# Altium schematic sheet Sensor Board.SchDoc
size A3; SheetNumber: 5; SheetTotal: 5
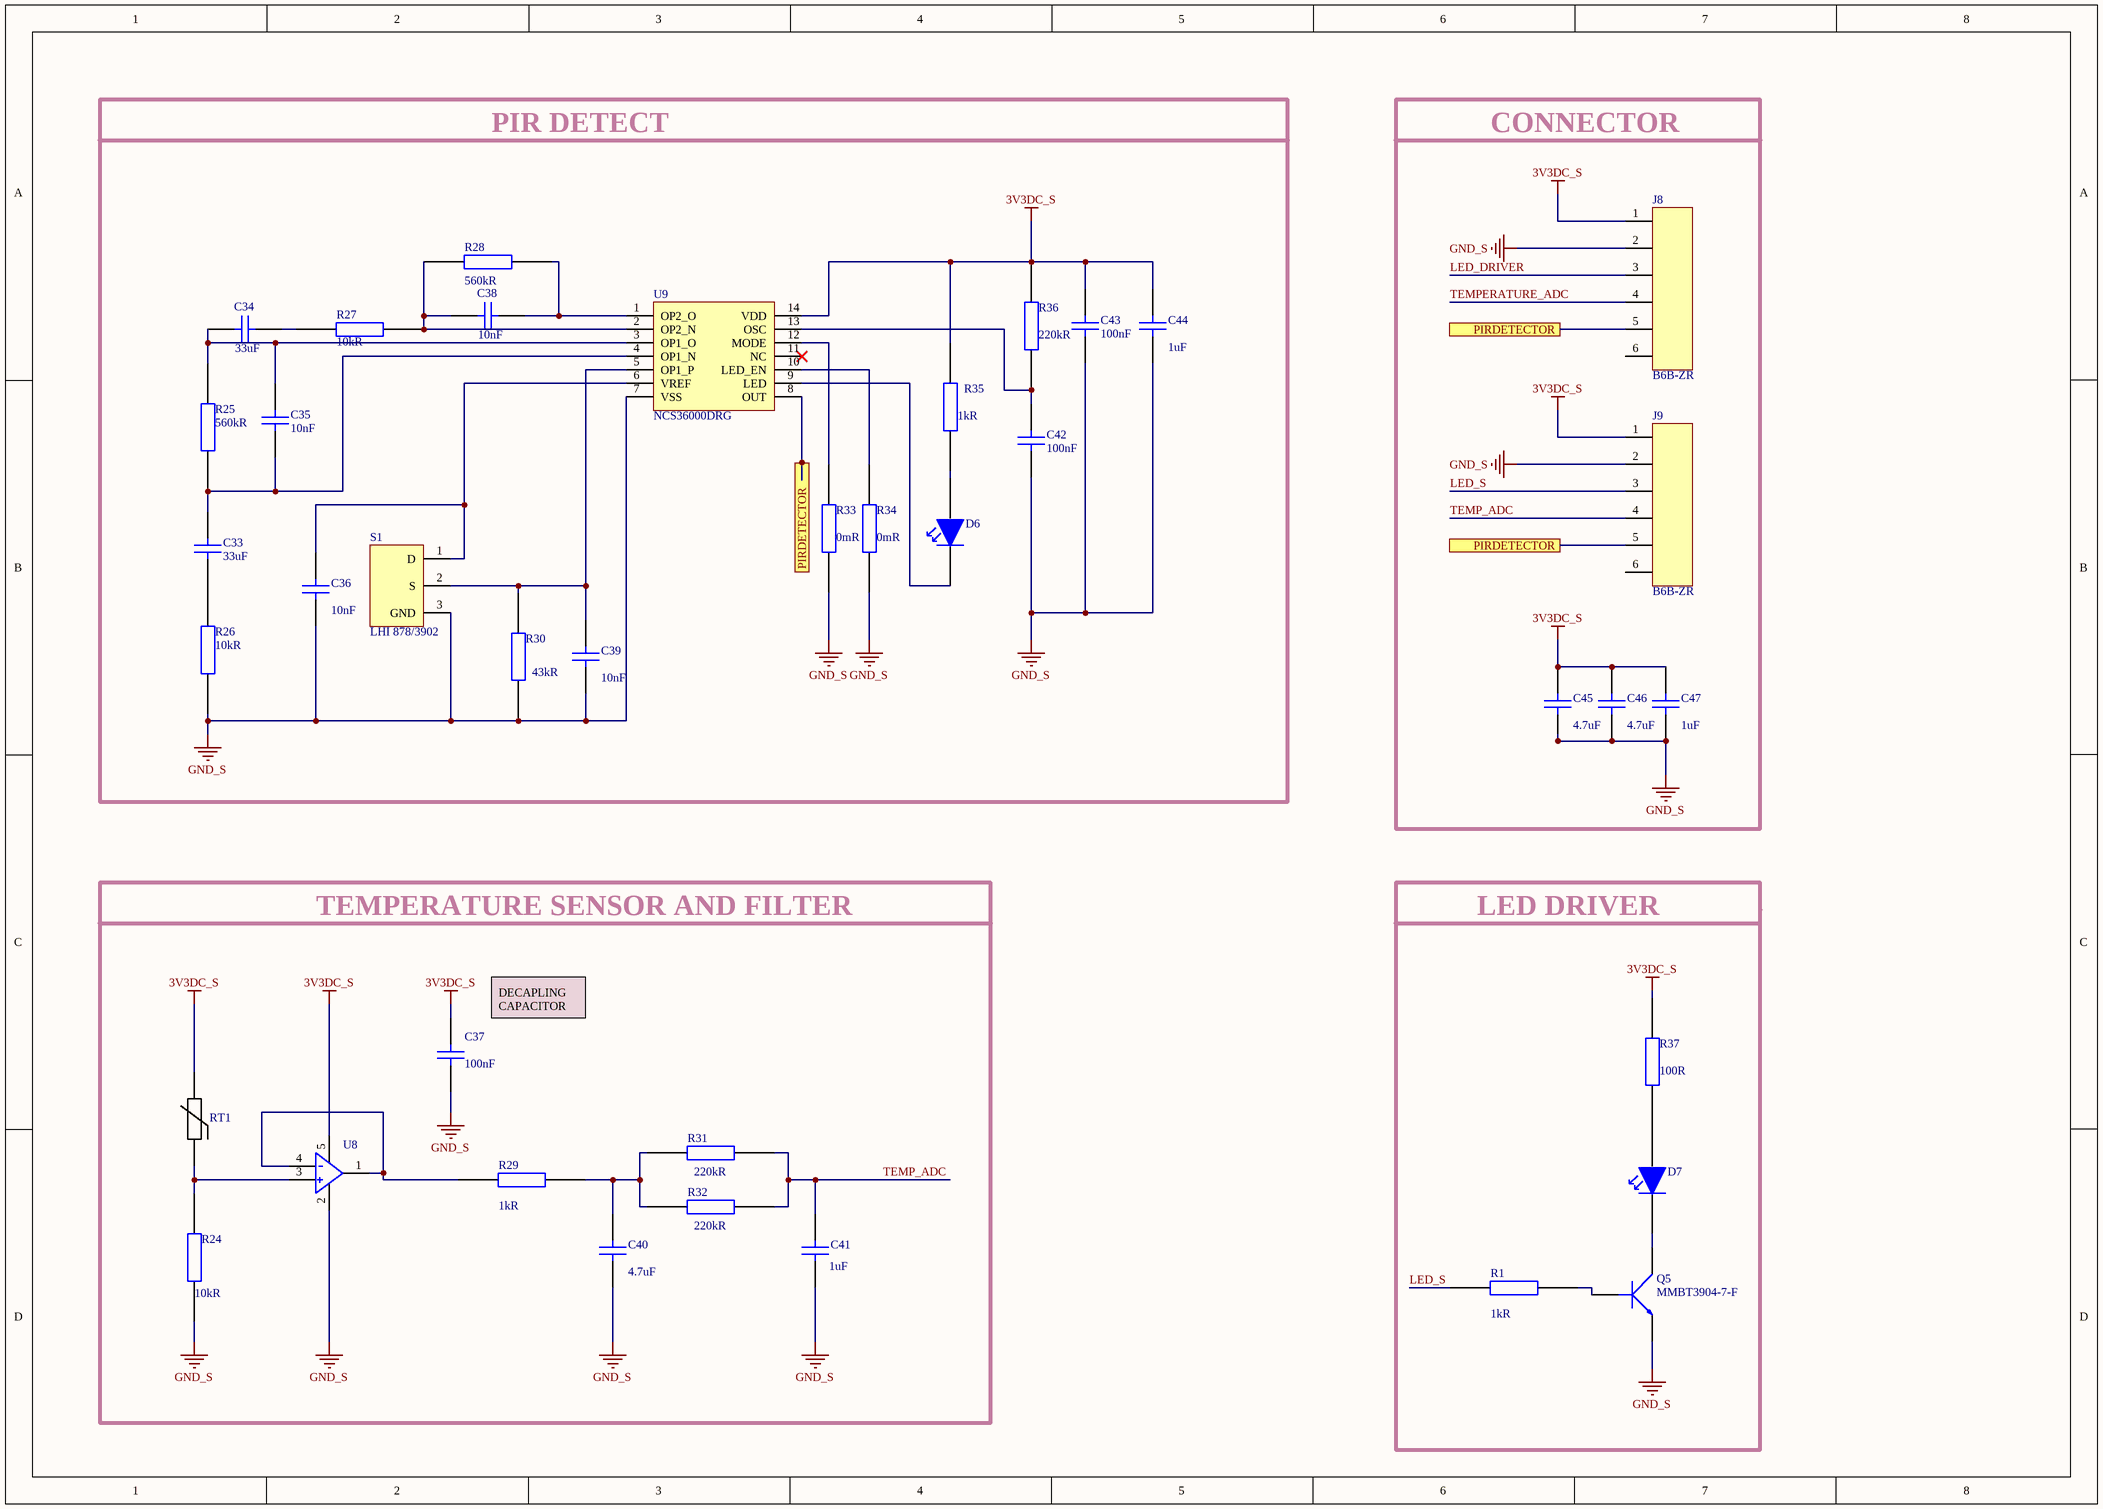
[diagram p0: Sensor Board.SchDoc]

## Parts
C33  value 33uF  [CAP_1206]  (hidden comment: C3216X5R1E336M160AC)
C34  value 33uF  [CAP_1206]  (hidden comment: C3216X5R1E336M160AC)
C35  Values: 10nF  [CAP_0603]  (hidden comment: 0603B103K160CT)
C36  Values: 10nF  [CAP_0603]  (hidden comment: 0603B103K160CT)
C37  value 100nF  [CAP_0603]  (hidden comment: C0603C104K5RAC7867)
C38  Values: 10nF  [CAP_0603]  (hidden comment: 0603B103K160CT)
C39  Values: 10nF  [CAP_0603]  (hidden comment: 0603B103K160CT)
C40  value 4.7uF  [CAP_0805]  (hidden comment: CL21A475KAQNNNE)
C41  value 1uF  [CAP_0805]  (hidden comment: CL21B105KBFNNNE)
C42  value 100nF  [CAP_0603]  (hidden comment: C0603C104K5RAC7867)
C43  value 100nF  [CAP_0603]  (hidden comment: C0603C104K5RAC7867)
C44  value 1uF  [CAP_0805]  (hidden comment: CL21B105KBFNNNE)
C45  value 4.7uF  [CAP_0805]  (hidden comment: CL21A475KAQNNNE)
C46  value 4.7uF  [CAP_0805]  (hidden comment: CL21A475KAQNNNE)
C47  value 1uF  [CAP_0805]  (hidden comment: CL21B105KBFNNNE)
D6  LTST-C171GKT  [LED_GREEN_0805]  (value not drawn)
D7  LH R974-LP-1-0-20-R18  [LED_RED_0805]  (value not drawn)
J8  B6B-ZR  [B6B-ZR]
J9  B6B-ZR  [B6B-ZR]
Q5  MMBT3904-7-F  [SOT-23F]
R1  value 1kR  [RES_0603]  (hidden comment: RC0603FR-0710KL)
R24  value 10kR  [RES_0603]  (hidden comment: RMCF0603JT10K0)
R25  value 560kR  [RES_0603]  (hidden comment: RC0603JR-07560KL)
R26  value 10kR  [RES_0603]  (hidden comment: RMCF0603JT10K0)
R27  value 10kR  [RES_0603]  (hidden comment: RMCF0603JT10K0)
R28  value 560kR  [RES_0603]  (hidden comment: RC0603JR-07560KL)
R29  value 1kR  [RES_0603]  (hidden comment: RC0603FR-0710KL)
R30  Values: 43kR  [RES_0603]  (hidden comment: RC0603JR-0743KL)
R31  Values: 220kR  [RES_0603]  (hidden comment: RC0603JR-07220KL)
R32  Values: 220kR  [RES_0603]  (hidden comment: RC0603JR-07220KL)
R33  value 0mR  [RES_0603]  (hidden comment: RC0603JR-070RL)
R34  value 0mR  [RES_0603]  (hidden comment: RC0603JR-070RL)
R35  value 1kR  [RES_0603]  (hidden comment: RC0603FR-0710KL)
R36  Values: 220kR  [RES_0603]  (hidden comment: RC0603JR-07220KL)
R37  value 100R  [RES_0603]  (hidden comment: RC0603FR-07100RL)
RT1  TFPT1206L1002FM  [RES_1206]  (value not drawn)
S1  LHI 878/3902  [LHI 878]
U8  OPA314AIDBVR  [SOT23_5]  (value not drawn)
U9  NCS36000DRG  [SOIC14]

## Ports
PIRDETECTOR (see Microcontroller[3B], Power Manangement[6D], Sensor Board[4B], Sensor Board[6A]), PIRDETECTOR (see Microcontroller[3B], Power Manangement[6D], Sensor Board[4B], Sensor Board[6B]), PIRDETECTOR (see Microcontroller[3B], Power Manangement[6D], Sensor Board[6A], Sensor Board[6B])

## Nets
3V3DC_S: C37.2 C43.2 C44.2 C45.2 C46.2 C47.2 J8.1 J9.1 R35.2 R36.1 R37.2 RT1.2 U8.5 U9.14(VDD)
GND_S: C36.1 C37.1 C39.1 C40.1 C41.2 C42.1 C43.1 C44.1 C45.1 C46.1 C47.1 J8.2 J9.2 Q5.2(E) R24.2 R26.1 R30.2 R33.1 R34.1 S1.3(GND) U8.2 U9.7(VSS)
LED_DRIVER: J8.3
LED_S: J9.3 R1.1
PIRDETECTOR: J8.5 J9.5 U9.8(OUT) ; port PIRDETECTOR
TEMP_ADC: C41.1 J9.4 R31.2 R32.2
TEMPERATURE_ADC: J8.4
NetC33_1: C33.1 C35.2 R25.1 U9.4(OP1_N)
NetC33_2: C33.2 R26.2
NetC34_1: C34.1 R27.1
NetC34_2: C34.2 C35.1 R25.2 U9.3(OP1_O)
NetC36_2: C36.2 S1.1(D) U9.6(VREF)
NetC38_1: C38.1 R27.2 R28.1 U9.2(OP2_N)
NetC38_2: C38.2 R28.2 U9.1(OP2_O)
NetC39_2: C39.2 R30.1 S1.2(S) U9.5(OP1_P)
NetC40_2: C40.2 R29.2 R31.1 R32.1
NetC42_2: C42.2 R36.2 U9.13(OSC)
NetD6_1: D6.1 U9.9(LED)
NetD6_2: D6.2 R35.1
NetD7_1: D7.1 Q5.3(C)
NetD7_2: D7.2 R37.1
NetQ5_1: Q5.1(B) R1.2
NetR24_1: R24.1 RT1.1 U8.3
NetR29_1: R29.1 U8.1 U8.4
NetR33_2: R33.2 U9.12(MODE)
NetR34_2: R34.2 U9.10(LED_EN)

Not connected (* = marked no-connect by the designer): J8 6; J9 6; U9 11(NC)*

## Notes on the sheet
- PIR DETECT
- CONNECTOR
- TEMPERATURE SENSOR AND FILTER
- LED DRIVER
- (near C37) DECAPLING CAPACITOR

## Library data of the parts
C33 C34 = CAP CER 33uF 1206: Multilayer Ceramic Capacitor, 33 uF, 25 V, ± 20%, 1206; Manufacturer: TDK; Designed By: Selenay; Material: 4241ConductorMaterial; Supplier: Digikey; Supplier Part Number: 445-8046-1-ND; Manufacturer Part Number: C3216X5R1E336M160AC; RoHS: Yes; Category: Ceramic Capacitors; Stock: 214020; Pricing: 1=0,98, 10=0,734, 50=0,6696, 100=0,5485, 500=0,43776, 1000=0,38625 (USD); ComponentLink1URL: https://datasheet.ciiva.com/24216/c3216x5r1e336m160ac-265051-24216512.pdf?src-supplier=Mouser; ComponentLink1Description: https://datasheet.ciiva.com/24216/c3216x5r1e336m160ac-265051-24216512.pdf?src-supplier=Mouser; ComponentLink2URL: https://datasheet.ciiva.com/6285/tdkmlcccaprange-6285278.pdf?src-supplier=Digikey; ComponentLink2Description: https://datasheet.ciiva.com/6285/tdkmlcccaprange-6285278.pdf?src-supplier=Digikey
C35 C36 C38 C39 = CAP CER 10nF 0603: 0603 16V X7R .01uF 10% multilayer ceramic capacitor; Manufacturer: Walsin Technologies; Designed By: Selenay; Supplier: Digikey; Supplier Part Number: 1292-1384-1-ND; Manufacturer Part Number: 0603B103K160CT; RoHS: Yes; Category: Ceramic Capacitors; Stock: 66698; Pricing: 1=0,1, 10=0,031, 50=0,018, 100=0,0139, 500=0,0105, 1000=0,00825 (USD); Lead Free: 5697LeadFree; ComponentLink1URL: http://www.farnell.com/datasheets/1958513.pdf?src-supplier=Farnell; ComponentLink1Description: http://www.farnell.com/datasheets/1958513.pdf?src-supplier=Farnell; ComponentLink2URL: https://datasheet.octopart.com/0603B103K160CT-Walsin-Technologies-datasheet-136037192.pdf?src-supplier=Future+Electronics; ComponentLink2Description: https://datasheet.octopart.com/0603B103K160CT-Walsin-Technologies-datasheet-136037192.pdf?src-supplier=Future+Electronics; ComponentLink3URL: http://www.passivecomponent.com/wp-content/uploads/2018/10/MLCC.pdf?src-supplier=Digikey; ComponentLink3Description: http://www.passivecomponent.com/wp-content/uploads/2018/10/MLCC.pdf?src-supplier=Digikey; ComponentLink4URL: https://datasheet.octopart.com/0603B103K160CT-Walsin-Technologies-datasheet-85392065.pdf?src-supplier=Element14; ComponentLink4Description: https://datasheet.octopart.com/0603B103K160CT-Walsin-Technologies-datasheet-85392065.pdf?src-supplier=Element14; ComponentLink5URL: https://datasheet.octopart.com/0603B103K160CT-Walsin-Technologies-datasheet-62066062.pdf?src-supplier=TME; ComponentLink5Description: https://datasheet.octopart.com/0603B103K160CT-Walsin-Technologies-datasheet-62066062.pdf?src-supplier=TME
C37 C42 C43 = CAP CER 100nF 0603: Multilayer Ceramic Capacitor, 0.1 uF, 50 V, ± 10%, X7R, 0603 [1608 Metric]; Manufacturer: KEMET; Manufacturer Part Number: C0603C104K5RACTU; Designed by: Selenay; Material: 4241ConductorMaterial; Voltage Rating: 50V; Temperature Coefficient: 30ppm/°C; Supplier: Digikey; Supplier Part Number: 399-C0603C104K5RAC7867CT-ND; RoHS: Yes; Category: Ceramic Capacitors; Stock: 2150274; Pricing: 1=0,11, 10=0,074, 50=0,0424, 100=0,0329, 500=0,02474, 1000=0,01944 (USD); Mounting Technology: Surface Mount; Case/Package: 0603; Min Operating Temperature: -55°C; Max Operating Temperature: 125°C; Tolerance: 10%; Dielectric: X7R; Packaging: Tape and Reel; Voltage: 50V; Series: SMD Comm X7R; Length: 0.063inch; Width: 0.031inch; Thickness: 0.034inch; RoHS Compliant: Yes; Lead Free: 5697LeadFree
C40 C45 C46 = CAP CER 4.7uF 0805: Multilayer Ceramic Capacitor, 4.7 uF, 25 V, ± 10%; Manufacturer: Samsung; Voltage Rating: 25V; Dielectric: X5R; Designed By: Selenay; Supplier: Digikey; Supplier Part Number: 1276-1244-1-ND; Manufacturer Part Number: CL21A475KAQNNNE; RoHS: Yes; Category: Ceramic Capacitors; Stock: 3215685; Pricing: 1=0,1, 10=0,069, 50=0,0414, 100=0,0326, 500=0,02408, 1000=0,01994 (USD); Mounting Technology: Surface Mount; Case/Package: 0805; Case Code (Metric): 2012; Case Code (Imperial): 0805; Material: Ceramic; Min Operating Temperature: -55°C; Max Operating Temperature: 85°C; Packaging: Tape and Reel; Tolerance: 10%; Voltage Rating (DC): 25V; Series: CL; Construction: Flat; Length: 2mm; Height: 1.25mm; Depth: 1.25mm; Radiation Hardening: No; Lead Free: Lead Free; RoHS Compliant: Yes; ComponentLink1URL: https://datasheet.ciiva.com/25798/cl21a475kaqnnne-25798882.pdf?src-supplier=Digikey; ComponentLink1Description: https://datasheet.ciiva.com/25798/cl21a475kaqnnne-25798882.pdf?src-supplier=Digikey
C41 C44 C47 = CAP CER 1uF 0805: Multilayer Ceramic Capacitor, 1 uF, 50 V, ± 10%, X7R, 0805 [2012 Metric]; Manufacturer: Samsung; Voltage Rating (DC): 50V; Designed By: Selenay; Supplier: Digikey; Supplier Part Number: 1276-1029-1-ND; Manufacturer Part Number: CL21B105KBFNNNE; RoHS: Yes; Category: Ceramic Capacitors; Stock: 1263322; Pricing: 1=0,11, 10=0,075, 50=0,045, 100=0,0354, 500=0,02616, 1000=0,02165 (USD); Mounting Technology: Surface Mount; Case/Package: 0805; Material: Ceramic; Case Code (Metric): 2012; Case Code (Imperial): 0805; Min Operating Temperature: -55°C; Max Operating Temperature: 125°C; Tolerance: 10%; Packaging: Tape and Reel; Package Quantity: 1; Voltage Rating: 50V; Dielectric: X7R; Voltage: 50V; Series: CL; Construction: Flat; Length: 2mm; Width: 0.049inch; Height: 1.25mm; Thickness: 0.053inch; Depth: 1.25mm; Radiation Hardening: No; RoHS Compliant: Yes; ComponentLink1URL: https://datasheet.ciiva.com/25800/cl21b105kbfnnne-25800291.pdf?src-supplier=Digikey; ComponentLink1Description: https://datasheet.ciiva.com/25800/cl21b105kbfnnne-25800291.pdf?src-supplier=Digikey
D6 = LED GREEN 0805: LED Low-Power Uni-Color Green 565nm 2.1V 2-Pin Chip LED T/R; Manufacturer: Vishay Lite-On; Lens Color: Colorless; Viewing Angle: 130°; Lens Style: Flat,Diffused,Colorless,Rectangular,Clear; Luminous Intensity: 12mcd; Forward Current: 30mA; Power Rating: 100mW; Dominant Wavelength: 569nm; Test Current: 10mA; Lens Transparency: Clear; Number of Elements: 1; Reverse Voltage: 5V; Lens Size: 1.25mm; Supplier: Digikey; Supplier Part Number: 160-1423-1-ND; Manufacturer Part Number: LTST-C171GKT; RoHS: Yes; Category: LEDs; Stock: 354410; Pricing: 1=0,26, 10=0,143, 100=0,0663, 500=0,0612, 1000=0,04794 (USD); Mounting Technology: Surface Mount; Case/Package: 0805; Pins: 2; Color: Green; Case Code (Metric): 2012; Case Code (Imperial): 0805; Min Operating Temperature: -55°C; Max Operating Temperature: 85°C; Package Quantity: 3000; Packaging: Tape and Reel; Forward Voltage: 2.1V; Illumination Color: Green; Power Dissipation: 100mW; Wavelength: 565nm; Number of LEDs: 1; Series: -; Length: 2mm; Width: 1.25mm; Height: 0.9mm; Depth: 1.25mm; Radiation Hardening: No; Lead Free: Lead Free; RoHS Compliant: Yes; ComponentLink1URL: https://datasheet.ciiva.com/2110/ltst-c171gkt-2110000.pdf?src-supplier=Digikey; ComponentLink1Description: https://datasheet.ciiva.com/2110/ltst-c171gkt-2110000.pdf?src-supplier=Digikey; ComponentLink2URL: https://datasheet.ciiva.com/11773/0900766b80dc0296-11773991.pdf?src-supplier=Rs; ComponentLink2Description: https://datasheet.ciiva.com/11773/0900766b80dc0296-11773991.pdf?src-supplier=Rs; ComponentLink3URL: https://datasheet.ciiva.com/12400/lite-on-ltst-c171gkt-190133-12400647.pdf?src-supplier=Mouser; ComponentLink3Description: https://datasheet.ciiva.com/12400/lite-on-ltst-c171gkt-190133-12400647.pdf?src-supplier=Mouser; ComponentLink4URL: https://datasheet.ciiva.com/2110/ltst-c171gkt-2110001.pdf?src-supplier=Digikey; ComponentLink4Description: https://datasheet.ciiva.com/2110/ltst-c171gkt-2110001.pdf?src-supplier=Digikey; ComponentLink5URL: https://datasheet.ciiva.com/2110/ltst-c171gkt-2110002.pdf?src-supplier=Digikey; ComponentLink5Description: https://datasheet.ciiva.com/2110/ltst-c171gkt-2110002.pdf?src-supplier=Digikey; ComponentLink6URL: https://datasheet.ciiva.com/16396/ltst-c171gkt-16396549.pdf?src-supplier=Future+Electronics; ComponentLink6Description: https://datasheet.ciiva.com/16396/ltst-c171gkt-16396549.pdf?src-supplier=Future+Electronics
D7 = LED RED 0805: Designed By: Selenay
J8 J9 = 64800611622_CONN_6PIN: Conn Shrouded Header (4 Sides) HDR 6 POS 1.5mm Solder ST Top Entry SMD T/R; Manufacturer: Wurth Electronics; Supplier: Digikey; Supplier Part Number: 732-64800611622-ND; Manufacturer Part Number: 64800611622; RoHS: No; Category: Uncategorized; Stock: 1308; Pricing: 1=0,41, 50=0,406, 100=0,384, 250=0,361, 500=0,339 (USD); ComponentLink1URL: https://datasheet.ciiva.com/16422/ezr-16422268.pdf?src-supplier=Future+Electronics; ComponentLink1Description: https://datasheet.ciiva.com/16422/ezr-16422268.pdf?src-supplier=Future+Electronics; ComponentLink2URL: https://datasheet.ciiva.com/15174/getdatasheetpartid-478490-15174613.pdf?src-supplier=Verical; ComponentLink2Description: https://datasheet.ciiva.com/15174/getdatasheetpartid-478490-15174613.pdf?src-supplier=Verical
Q5 = MMBT3904-7-F: Transistor General Purpose BJT NPN 40 Volt 0.2A Automotive 3-Pin SOT-23; Manufacturer: Diodes Zetex; Designed By: Selenay; Max Power Dissipation: 300mW; Collector Emitter Voltage (VCEO): 40V; Max Collector Current: 200mA; Collector Base Voltage (VCBO): 60V; Power Dissipation: 350mW; Frequency: 300MHz; hFE Min: 100; Number of Elements: 1; Emitter Base Voltage (VEBO): 6V; Collector Emitter Saturation Voltage: 300mV; Supplier: Digikey; Supplier Part Number: MMBT3904-FDICT-ND; Manufacturer Part Number: MMBT3904-7-F; RoHS: Yes; Category: BJTs; Stock: 4398181; Pricing: 1=0,12, 10=0,086, 100=0,0467, 500=0,03666, 1000=0,02545 (USD); Mounting Technology: Surface Mount; Case/Package: SOT-23; Pins: 3; Weight: 0.000282oz; Min Operating Temperature: -55°C; Max Operating Temperature: 150°C; Polarity: NPN; Packaging: Tape and Reel; Voltage Rating (DC): 40V; Package Quantity: 3000; Transition Frequency: 300MHz; Collector Emitter Breakdown Voltage: 40V; Max Breakdown Voltage: 40V; Continuous Collector Current: 200mA; Clock Frequency: 300MHz; Gain Bandwidth Product: 300MHz; Series: Automotive, AEC-Q101; Collector-emitter Voltage-Max: 300mV; Length: 3.05mm; Width: 1.4mm; Height: 1mm; Radiation Hardening: No; Reach SVHC Compliant: No; Lead Free: Lead Free; RoHS Compliant: Yes; ComponentLink1URL: https://datasheet.ciiva.com/11201/ds30036-11201778.pdf?src-supplier=Avnet; ComponentLink1Description: https://datasheet.ciiva.com/11201/ds30036-11201778.pdf?src-supplier=Avnet; ComponentLink2URL: https://datasheet.ciiva.com/15138/getdatasheetpartid-53265-15138780.pdf?src-supplier=Verical; ComponentLink2Description: https://datasheet.ciiva.com/15138/getdatasheetpartid-53265-15138780.pdf?src-supplier=Verical; ComponentLink3URL: https://datasheet.ciiva.com/22711/1915516-22711750.pdf?src-supplier=Element14; ComponentLink3Description: https://datasheet.ciiva.com/22711/1915516-22711750.pdf?src-supplier=Element14; ComponentLink4URL: https://datasheet.ciiva.com/11198/ds30036-11198999.pdf?src-supplier=Avnet; ComponentLink4Description: https://datasheet.ciiva.com/11198/ds30036-11198999.pdf?src-supplier=Avnet; ComponentLink5URL: https://datasheet.ciiva.com/6361/ds30036-6361256.pdf?src-supplier=Digikey; ComponentLink5Description: https://datasheet.ciiva.com/6361/ds30036-6361256.pdf?src-supplier=Digikey; ComponentLink6URL: https://datasheet.ciiva.com/6361/ds30036-6361254.pdf?src-supplier=Digikey; ComponentLink6Description: https://datasheet.ciiva.com/6361/ds30036-6361254.pdf?src-supplier=Digikey
R1 R29 R35 = RES 1K OHM 0603: SMD Chip Resistor, 1 kOhm, ± 1%, 100 mW, 0603 [1608 Metric], Thick Film, General Purpose; Manufacturer: Yageo; Manufacturer Part Number: RC0603FR-071KL; Designed by: Selenay; Temperature Coefficient: 100ppm/°C; Power Rating: 100mW; Voltage Rating: 50V; Supplier: Digikey; Supplier Part Number: 311-1.00KHRCT-ND; RoHS: Yes; Category: Chip SMD Resistors; Stock: 14334502; Pricing: 1=0,1, 10=0,019, 50=0,0112, 100=0,0093, 500=0,00622, 1000=0,00532 (USD); Case/Package: 0603; Contact Plating: Tin,Matte; Case Code (Imperial): 0603; Case Code (Metric): 1608; Min Operating Temperature: -55°C; Max Operating Temperature: 155°C; Tolerance: 1%; Packaging: Tape and Reel; Resistor Type: Thick Film; Termination: SMD/SMT; Features: Moisture Resistant; Series: RC; Max Power Dissipation: 100mW; Number of Terminations: 2; Resistance Tolerance: 1%; Construction: Rectangular; Technology: THICK FILM; Length: 1.6mm; Height: 0.45mm; Depth: 0.8mm; Reach SVHC Compliant: No; Lead Free: 5697LeadFree; Military Standard: Not; RoHS Compliant: Yes
R24 R26 R27 = RES 10K OHM 0603: Res Thick Film 0603 10K Ohm 5% 1/10W ±100ppm/°C Molded SMD SMD Paper T/R; Manufacturer: Stackpole Electronics; Designed By: Selenay; Supplier: Digikey; Supplier Part Number: RMCF0603JT10K0CT-ND; Manufacturer Part Number: RMCF0603JT10K0; RoHS: Yes; Category: Chip SMD Resistors; Stock: 14399484; Pricing: 1=0,1, 10=0,021, 50=0,0116, 100=0,0093, 500=0,00594, 1000=0,005 (USD); ComponentLink1URL: https://datasheet.ciiva.com/15193/getdatasheetpartid-364254-15193501.pdf?src-supplier=Verical; ComponentLink1Description: https://datasheet.ciiva.com/15193/getdatasheetpartid-364254-15193501.pdf?src-supplier=Verical
R25 R28 = RES 560K OHM 0603: SMD Chip Resistor, 560 kOhm, ± 5%, 100 mW, 0603 [1608 Metric], Thick Film, General Purpose; Manufacturer: Yageo; Power Rating: 100mW; Voltage Rating: 75V; Voltage Rating (DC): 50V; Temperature Coefficient: 100ppm/°C; Designed By: Selenay; Supplier: Digikey; Supplier Part Number: 311-560KGRCT-ND; Manufacturer Part Number: RC0603JR-07560KL; RoHS: Yes; Category: Chip SMD Resistors; Stock: 410418; Pricing: 1=0,1, 10=0,015, 50=0,0092, 100=0,0076, 500=0,00512, 1000=0,00437 (USD); Case/Package: 0603; Pins: 2; Case Code (Metric): 1608; Case Code (Imperial): 0603; Weight: 7.1E-05oz; Min Operating Temperature: -55°C; Max Operating Temperature: 155°C; Package Quantity: 1; Tolerance: 5%; Packaging: Tape and Reel; Resistor Type: Thick Film; Number of Terminations: 2; Termination: SMD/SMT; Max Power Dissipation: 100mW; Working Voltage: 75V; Features: Moisture Resistant; Series: RC; Resistance Tolerance: 5%; Technology: THICK FILM; Voltage Rating (AC): 50V; Length: 0.063inch; Width: 0.8mm; Height: 0.022inch; RoHS Compliant: Yes; Reach SVHC Compliant: Unknown; Lead Free: 5697LeadFree; ComponentLink1URL: https://datasheet.ciiva.com/2453/pyu-r-int-thick-7-2453056.pdf?src-supplier=Digikey; ComponentLink1Description: https://datasheet.ciiva.com/2453/pyu-r-int-thick-7-2453056.pdf?src-supplier=Digikey; ComponentLink2URL: https://datasheet.ciiva.com/2453/pyu-r-int-thick-7-2453057.pdf?src-supplier=Digikey; ComponentLink2Description: https://datasheet.ciiva.com/2453/pyu-r-int-thick-7-2453057.pdf?src-supplier=Digikey; ComponentLink3URL: https://datasheet.ciiva.com/2453/pyu-r-int-thick-7-2453055.pdf?src-supplier=Digikey; ComponentLink3Description: https://datasheet.ciiva.com/2453/pyu-r-int-thick-7-2453055.pdf?src-supplier=Digikey
R30 = RES 43K OHM 0603: Res Thick Film 0603 43K Ohm 5% 0.1W(1/10W); Manufacturer: Yageo; Designed By: Selenay; Supplier: Digikey; Supplier Part Number: 311-43KGRCT-ND; Manufacturer Part Number: RC0603JR-0743KL; RoHS: Yes; Category: Chip SMD Resistors; Stock: 230924; Pricing: 1=0,1, 10=0,011, 50=0,0066, 100=0,0054, 500=0,0036, 1000=0,00307 (USD); ComponentLink1URL: https://datasheet.ciiva.com/2453/pyu-r-int-thick-7-2453052.pdf?src-supplier=Digikey; ComponentLink1Description: https://datasheet.ciiva.com/2453/pyu-r-int-thick-7-2453052.pdf?src-supplier=Digikey; ComponentLink2URL: https://datasheet.ciiva.com/2453/pyu-r-int-thick-7-2453053.pdf?src-supplier=Digikey; ComponentLink2Description: https://datasheet.ciiva.com/2453/pyu-r-int-thick-7-2453053.pdf?src-supplier=Digikey; ComponentLink3URL: https://datasheet.ciiva.com/2453/pyu-r-int-thick-7-2453054.pdf?src-supplier=Digikey; ComponentLink3Description: https://datasheet.ciiva.com/2453/pyu-r-int-thick-7-2453054.pdf?src-supplier=Digikey
R31 R32 R36 = RES 220K OHM 0603: SMD Chip Resistor, 220 kOhm, ± 5%, 100 mW, 0603; Manufacturer: Yageo; Designed By: Selenay; Voltage Rating (AC): 50V; Supplier: Digikey; Supplier Part Number: 311-220KGRCT-ND; Manufacturer Part Number: RC0603JR-07220KL; RoHS: Yes; Category: Chip SMD Resistors; Stock: 653871; Pricing: 1=0,1, 10=0,015, 50=0,0092, 100=0,0076, 500=0,00512, 1000=0,00437 (USD); Lead Free: 5697LeadFree; ComponentLink1URL: https://datasheet.ciiva.com/2452/pyu-r-int-thick-7-2452923.pdf?src-supplier=Digikey; ComponentLink1Description: https://datasheet.ciiva.com/2452/pyu-r-int-thick-7-2452923.pdf?src-supplier=Digikey; ComponentLink2URL: https://datasheet.ciiva.com/2452/pyu-r-int-thick-7-2452924.pdf?src-supplier=Digikey; ComponentLink2Description: https://datasheet.ciiva.com/2452/pyu-r-int-thick-7-2452924.pdf?src-supplier=Digikey; ComponentLink3URL: https://datasheet.ciiva.com/2452/pyu-r-int-thick-7-2452925.pdf?src-supplier=Digikey; ComponentLink3Description: https://datasheet.ciiva.com/2452/pyu-r-int-thick-7-2452925.pdf?src-supplier=Digikey
R33 R34 = RES 0 OHM 0603: GENERAL PURPOSE CHIP RESISTOR Metal Glaze/thick Film, 0.1W, 0ohm, Surface Mount, 0603; Manufacturer: Yageo; Tolerance: 1%; Power Rating: 100mW; Voltage Rating (DC): 50V; Temperature Coefficient: 200ppm/°C; Resistance Tolerance: 5%; Designed By: Selenay; Supplier: Digikey; Supplier Part Number: 311-0.0GRCT-ND; Manufacturer Part Number: RC0603JR-070RL; RoHS: Yes; Category: Chip SMD Resistors; Stock: 4318611; Pricing: 1=0,1, 10=0,015, 25=0,0112, 50=0,0086, 100=0,006, 250=0,0048, 500=0,00386, 1000=0,00284 (USD); Case/Package: 0603; Pins: 2; Contact Plating: Tin,Matte; Case Code (Imperial): 0603; Case Code (Metric): 1608; Min Operating Temperature: -55°C; Max Operating Temperature: 155°C; Resistor Type: Thick Film; Packaging: Tape and Reel; Termination: SMD/SMT; Series: RC; Technology: THICK FILM; Package Quantity: 5000; Voltage Rating: 50V; Features: Moisture Resistant; Max Power Dissipation: 100mW; Number of Terminations: 2; Construction: Rectangular; Length: 1.6mm; Width: 0.8mm; Height: 0.45mm; Depth: 0.8mm; RoHS Compliant: Yes; Reach SVHC Compliant: Unknown; Lead Free: 5697LeadFree; Military Standard: Not; ComponentLink1URL: https://datasheet.ciiva.com/11808/pyu-r-int-6-11808700.pdf?src-supplier=Rs; ComponentLink1Description: https://datasheet.ciiva.com/11808/pyu-r-int-6-11808700.pdf?src-supplier=Rs; ComponentLink2URL: https://datasheet.ciiva.com/22747/443971-22747530.pdf?src-supplier=Element14; ComponentLink2Description: https://datasheet.ciiva.com/22747/443971-22747530.pdf?src-supplier=Element14; ComponentLink3URL: https://datasheet.ciiva.com/12555/rc0603-272842-12555254.pdf?src-supplier=Mouser; ComponentLink3Description: https://datasheet.ciiva.com/12555/rc0603-272842-12555254.pdf?src-supplier=Mouser; ComponentLink4URL: https://datasheet.ciiva.com/7746/1738695-7746421.pdf?src-supplier=Element14; ComponentLink4Description: https://datasheet.ciiva.com/7746/1738695-7746421.pdf?src-supplier=Element14; ComponentLink5URL: https://datasheet.ciiva.com/7746/1738695-7746422.pdf?src-supplier=Element14; ComponentLink5Description: https://datasheet.ciiva.com/7746/1738695-7746422.pdf?src-supplier=Element14; ComponentLink6URL: https://datasheet.ciiva.com/8883/pyu-rc0603-51-rohs-l-4-8883045.pdf?src-supplier=Avnet; ComponentLink6Description: https://datasheet.ciiva.com/8883/pyu-rc0603-51-rohs-l-4-8883045.pdf?src-supplier=Avnet; ComponentLink7URL: https://datasheet.ciiva.com/15189/getdatasheetpartid-329462-15189845.pdf?src-supplier=Verical; ComponentLink7Description: https://datasheet.ciiva.com/15189/getdatasheetpartid-329462-15189845.pdf?src-supplier=Verical
R37 = RES 100 OHM 0603: SMD Chip Resistor, 100 Ohm, ± 1%, 100 mW, 0603; Manufacturer: Yageo; Designed By: Selenay; Temperature Coefficient: 100ppm/°C; Voltage Rating (DC): 50V; Power Rating: 100mW; Supplier: Digikey; Supplier Part Number: 311-100HRCT-ND; Manufacturer Part Number: RC0603FR-07100RL; RoHS: Yes; Category: Chip SMD Resistors; Stock: 3016709; Pricing: 1=0,1, 10=0,019, 50=0,0112, 100=0,0093, 500=0,00622, 1000=0,00532 (USD); Case/Package: 0603; Pins: 2; Case Code (Imperial): 0603; Case Code (Metric): 1608; Min Operating Temperature: -55°C; Max Operating Temperature: 155°C; Tolerance: 1%; Resistor Type: Thick Film; Packaging: Tape and Reel; Voltage Rating: 50V; Termination: SMD/SMT; Features: Moisture Resistant; Series: RC; Max Power Dissipation: 100mW; Number of Terminations: 2; Construction: Rectangular; Resistance Tolerance: 1%; Technology: THICK FILM; Length: 1.6mm; Width: 0.8mm; Height: 0.45mm; Depth: 0.8mm; Lead Free: Lead Free; Reach SVHC Compliant: Unknown; RoHS Compliant: Yes; Military Standard: Not
RT1 = TFPT1206L1002FM: Thermistor PTC 10K Ohm 1% 2-Pin 1206 Surface Mount Solder Pad T/R Automotive; Manufacturer: Vishay Dale; Designed By: Selenay; Value: 10kR; Power Rating: 125mW; Voltage: 40V; Supplier: Digikey; Supplier Part Number: 541-3533-1-ND; Manufacturer Part Number: TFPT1206L1002FM; RoHS: Yes; Category: Linear ICs; Stock: 8789; Pricing: 1=1,32, 10=0,992, 25=0,7936, 100=0,7274, 500=0,61166, 1000=0,54554 (USD); Mounting Technology: Surface Mount; Case/Package: 1206; Case Code (Imperial): 1206; Min Operating Temperature: -55°C; Max Operating Temperature: 125°C; Packaging: Tape and Reel; Package Quantity: 5000; Tolerance: 1%; Max Power Dissipation: 125mW; Termination: SMD/SMT; Series: TFPT; Resistance Tolerance: 1%; Length: 3.2mm; Width: 1.6mm; Height: 0.55mm; Lead Free: Lead Free; RoHS Compliant: Yes; ComponentLink1URL: https://datasheet.ciiva.com/2852/tfpt-2852076.pdf?src-supplier=Digikey; ComponentLink1Description: https://datasheet.ciiva.com/2852/tfpt-2852076.pdf?src-supplier=Digikey
S1 = LHI 878/3902: SENSOR PYRO DETECTOR DUAL MOTION; Designed by: Selenay; Max Supply Voltage: 12; Min Supply Voltage: 2; Supplyer 1: Digi-Key; Type: Pyro Detector; Supplier Part Number: 1601-LHI878/3902-ND
U8 = OPA314: IC OPAMP GP 3MHZ RRO SOT23-5; Manufacturer: Texas Instruments; Designed By: Selenay; Supplier: Digikey; Supplier Part Number: 296-36699-1-ND; Manufacturer Part Number: OPA314AIDBVR; RoHS: Yes; Category: Amplifiers - Op Amps, Buffer, Instrumentation; Stock: 19863; Pricing: 1=1,16, 10=1,034, 25=0,9812, 100=0,8061, 250=0,75352, 500=0,6659, 1000=0,5257 (USD); ComponentLink1URL: https://datasheet.ciiva.com/14456/opa2314-14456281.pdf?src-supplier=Avnet; ComponentLink1Description: https://datasheet.ciiva.com/14456/opa2314-14456281.pdf?src-supplier=Avnet; ComponentLink2URL: https://datasheet.ciiva.com/14462/opa2314-14462006.pdf?src-supplier=Avnet; ComponentLink2Description: https://datasheet.ciiva.com/14462/opa2314-14462006.pdf?src-supplier=Avnet; ComponentLink3URL: https://datasheet.ciiva.com/29638/opa314-29638827.pdf?src-supplier=Digikey; ComponentLink3Description: https://datasheet.ciiva.com/29638/opa314-29638827.pdf?src-supplier=Digikey
U9 = NCS36000: PIR CONTROLLER  NCS36000 Series Single 5.75V Passive Infrared Detector Controller (PIR) -SOIC-14; Manufacturer: ON Semiconductor; Designed By: Selenay; Operating Supply Current: 50uA; Quiescent Current: 20uA; Min Supply Voltage: 3V; Output Type: Digital; Supplier: Rs; Supplier Part Number: 8051766P; Manufacturer Part Number: NCS36000DRG; RoHS: Yes; Category: Amplifiers - Op Amps, Buffer, Instrumentation; Pricing: 50=0,757, 100=0,659 (GBP); Case/Package: SOIC; Pins: 14; Min Operating Temperature: -40°C; Max Operating Temperature: 85°C; Package Quantity: 3000; Packaging: Tape and Reel; Max Supply Voltage: 5.75V; Series: -; Input Type: DIGITAL; Nominal Supply Current: 20uA; Length: 8.75mm; Width: 4mm; Height: 1.5mm; Radiation Hardening: No; Reach SVHC Compliant: No; Lead Free: Lead Free; Halogen Free: Halogen Free; RoHS Compliant: Yes; ComponentLink1URL: https://datasheet.ciiva.com/4763/ncs36000-d-89569-4763639.pdf?src-supplier=Mouser; ComponentLink1Description: https://datasheet.ciiva.com/4763/ncs36000-d-89569-4763639.pdf?src-supplier=Mouser; ComponentLink2URL: https://datasheet.ciiva.com/2966/ncs36000-d-2966525.pdf?src-supplier=Avnet; ComponentLink2Description: https://datasheet.ciiva.com/2966/ncs36000-d-2966525.pdf?src-supplier=Avnet